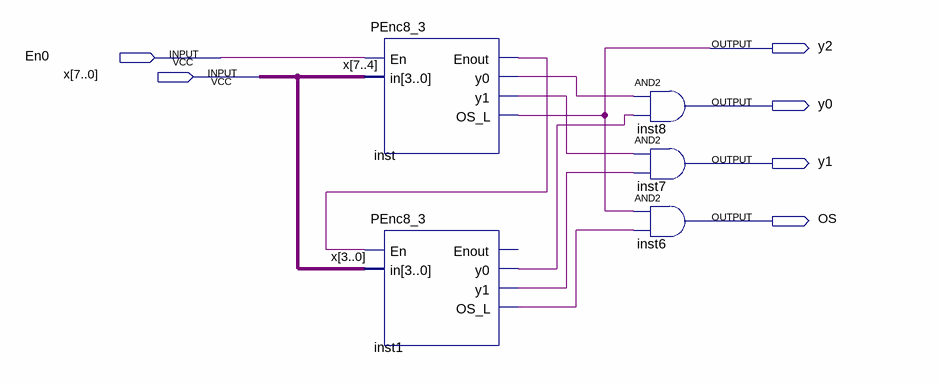
[diagram p0: schematic sheet]
// Quartus schematic PEnc8_3_T.bdf as structural Verilog: 5 symbols, 6 pins
module PEnc8_3_T (
  input  En0,
  input  [7:0] x,
  output y2,
  output y0,
  output y1,
  output OS
);

  wire inst1_os_l, inst1_y0, inst1_y1, inst_enout, inst_y0, inst_y1;

  PEnc8_3 inst (.En(En0), .in(x[7:4]), .Enout(inst_enout), .y0(inst_y0), .y1(inst_y1), .OS_L(y2));
  PEnc8_3 inst1 (.En(inst_enout), .in(x[3:0]), .y0(inst1_y0), .y1(inst1_y1), .OS_L(inst1_os_l));  // open: Enout
  and inst8 (y0, inst_y0, inst1_y0);
  and inst7 (y1, inst_y1, inst1_y1);
  and inst6 (OS, y2, inst1_os_l);
endmodule
